# Altium schematic sheet current_sense.SchDoc
size A4
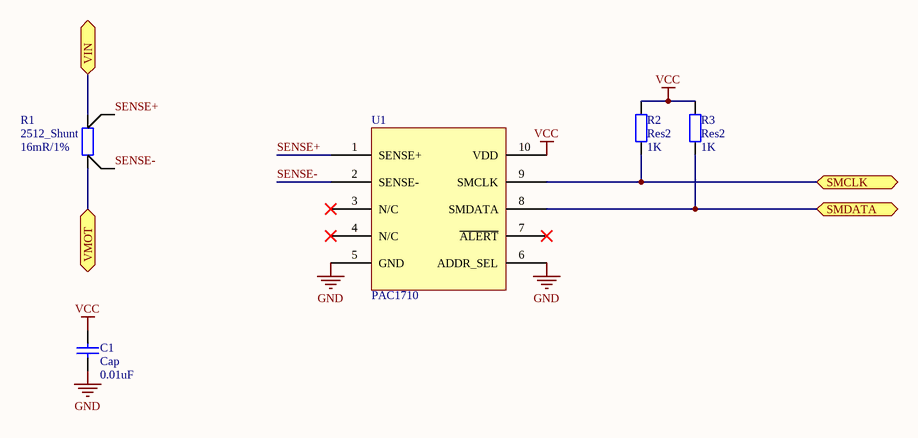
[diagram p0: current_sense.SchDoc]

## Parts
C1  Cap  value 0.01uF  [RAD-0.3]
R1  Package: 2512_Shunt  [SMD_Resistor-shunt_2512]  (hidden comment: 16mR/1%)
R2  Res2  value 1K  [AXIAL-0.4]
R3  Res2  value 1K  [AXIAL-0.4]
U1  PAC1710

## Ports
SMCLK (bidir), SMDATA (bidir), VIN, VMOT

## Nets
GND: C1.1 U1.5(GND) U1.6(ADDR_SEL)
VCC: C1.2 R2.2 R3.2 U1.10(VDD)
SENSE+: R1.3 U1.1(SENSE+)
SENSE-: R1.2 U1.2(SENSE-)
SMCLK: R2.1 U1.9(SMCLK) ; port SMCLK
SMDATA: R3.1 U1.8(SMDATA) ; port SMDATA
VIN: R1.4 ; port VIN
VMOT: R1.1 ; port VMOT

Not connected (* = marked no-connect by the designer): U1 3(N/C)* 4(N/C)* 7(~{ALERT})*

## Library data of the parts
C1 = Cap: Capacitor; Published: 8-Jun-2000; LatestRevisionDate: 17-Jul-2002; LatestRevisionNote: Re-released for DXP Platform.; PackageReference: RAD-0.3; Publisher: Altium Limited; PackageDescription: Radial Cap, Thru-Hole; 2 Leads; 0.3 in Pin Spacing
R1 = 352115RFT: TE CONNECTIVITY  352115RFT  RESISTOR, 2512, 2W, 15R, 1%; Temperature Coefficient: ± 100ppm/°C; Manufacturer: TE CONNECTIVITY; ManufacturerPartNumber: 352115RFT; Power Rating: 2 W; Farnell: http://pl.farnell.com/te-connectivity/352115rft/resistor-2512-2w-15r-1/dp/2117454; Manufacturer's Datasheet: http://www.farnell.com/datasheets/1610601.pdf; Value: 16mR/1%
R2 R3 = Res2: Resistor; Published: 8-Jun-2000; LatestRevisionDate: 17-Jul-2002; LatestRevisionNote: Re-released for DXP Platform.; PackageReference: AXIAL-0.4; Publisher: Altium Limited; PackageDescription: Axial Device, Thru-Hole; 2 Leads; 0.4 in Pin Spacing